# Altium schematic sheet PuertosSensores.SchDoc
size A4
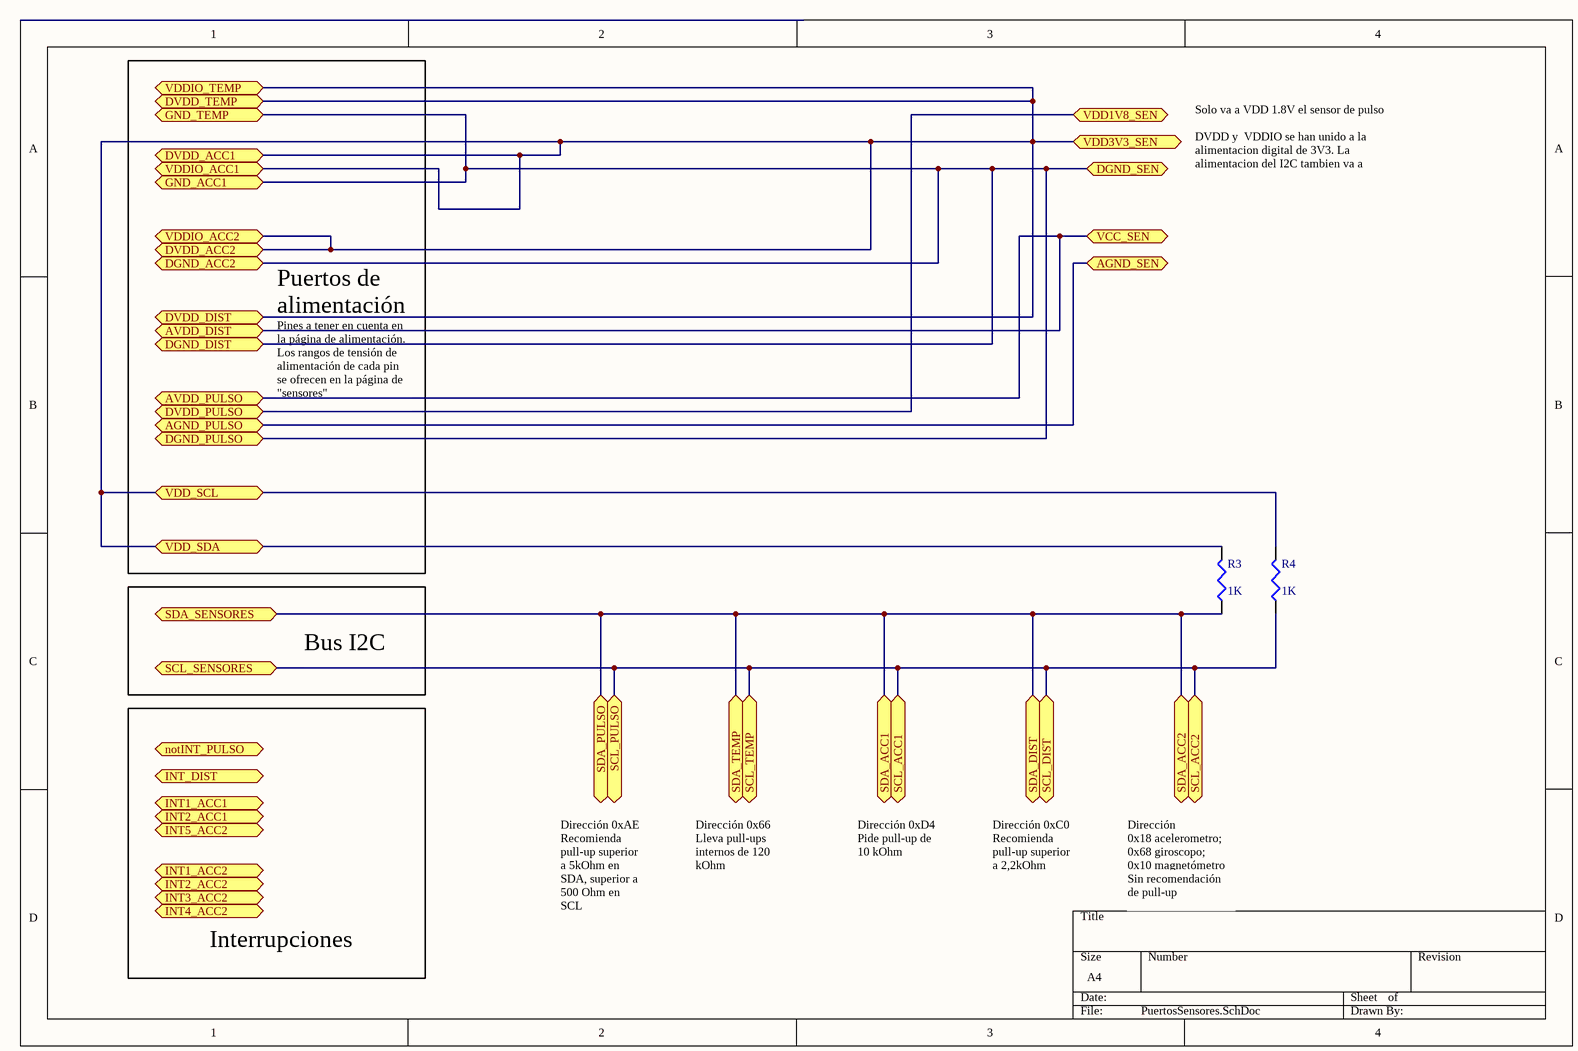
[diagram p0: PuertosSensores.SchDoc]

## Parts
R3  value 1K  [J1-0603]
R4  value 1K  [J1-0603]

## Ports
AGND_PULSO, AGND_SEN, AVDD_DIST, AVDD_PULSO, DGND_ACC2, DGND_DIST, DGND_PULSO, DGND_SEN, DVDD_ACC1, DVDD_ACC2, DVDD_DIST, DVDD_PULSO, DVDD_TEMP, GND_ACC1, GND_TEMP, INT1_ACC1, INT1_ACC2, INT2_ACC1, INT2_ACC2, INT3_ACC2, INT4_ACC2, INT5_ACC2, INT_DIST, notINT_PULSO, SCL_ACC1, SCL_ACC2, SCL_DIST, SCL_PULSO, SCL_SENSORES, SCL_TEMP, SDA_ACC1, SDA_ACC2, SDA_DIST, SDA_PULSO, SDA_SENSORES, SDA_TEMP, VCC_SEN, VDD1V8_SEN, VDD3V3_SEN, VDD_SCL, VDD_SDA, VDDIO_ACC1, VDDIO_ACC2, VDDIO_TEMP

## Nets
AGND_PULSO: port AGND_PULSO, port AGND_SEN
AVDD_DIST: port AVDD_PULSO, port AVDD_DIST, port VCC_SEN
DGND_ACC2: port GND_TEMP, port DGND_PULSO, port DGND_DIST, port GND_ACC1, port DGND_ACC2, port DGND_SEN
DVDD_ACC1: R3.2 R4.2 ; port VDD_SCL, port VDD_SDA, port DVDD_TEMP, port VDDIO_TEMP, port DVDD_DIST, port DVDD_ACC1, port VDDIO_ACC1, port DVDD_ACC2, port VDDIO_ACC2, port VDD3V3_SEN
DVDD_PULSO: port DVDD_PULSO, port VDD1V8_SEN
SCL_ACC1: R4.1 ; port SCL_SENSORES, port SCL_TEMP, port SCL_PULSO, port SCL_DIST, port SCL_ACC1, port SCL_ACC2
SDA_ACC1: R3.1 ; port SDA_SENSORES, port SDA_TEMP, port SDA_PULSO, port SDA_DIST, port SDA_ACC1, port SDA_ACC2

## Notes on the sheet
- Solo va a VDD 1.8V el sensor de pulso
- DVDD y  VDDIO se han unido a la alimentacion digital de 3V3. La alimentacion del I2C tambien va a 3,3V
- Puertos de alimentación
- Pines a tener en cuenta en la página de alimentación. Los rangos de tensión de alimentación de cada pin se ofrecen en la página de "sensores"
- Bus I2C
- Dirección 0xAE
- Dirección 0x66
- Dirección 0xD4
- Recomienda pull-up superior a 2,2kOhm
- Dirección 0xC0
- Dirección
  0x18 acelerometro;
  0x68 giroscopo;
  0x10 magnetómetro
- Recomienda pull-up superior a 5kOhm en SDA, superior a 500 Ohm en SCL
- Lleva pull-ups internos de 120 kOhm
- Pide pull-up de 10 kOhm
- Sin recomendación de pull-up
- Interrupciones

## Library data of the parts
R3 R4 = Res3: Resistor; Published: 8-Jun-2000; LatestRevisionDate: 29-May-2009; LatestRevisionNote: IPC-7351 Footprint Added.; PackageReference: J1-0603; Publisher: Altium Limited; PackageDescription: Chip Resistor